# EAGLE schematic EMMA_ultrasonic_sensor_bus (EAGLE 6.5.0)
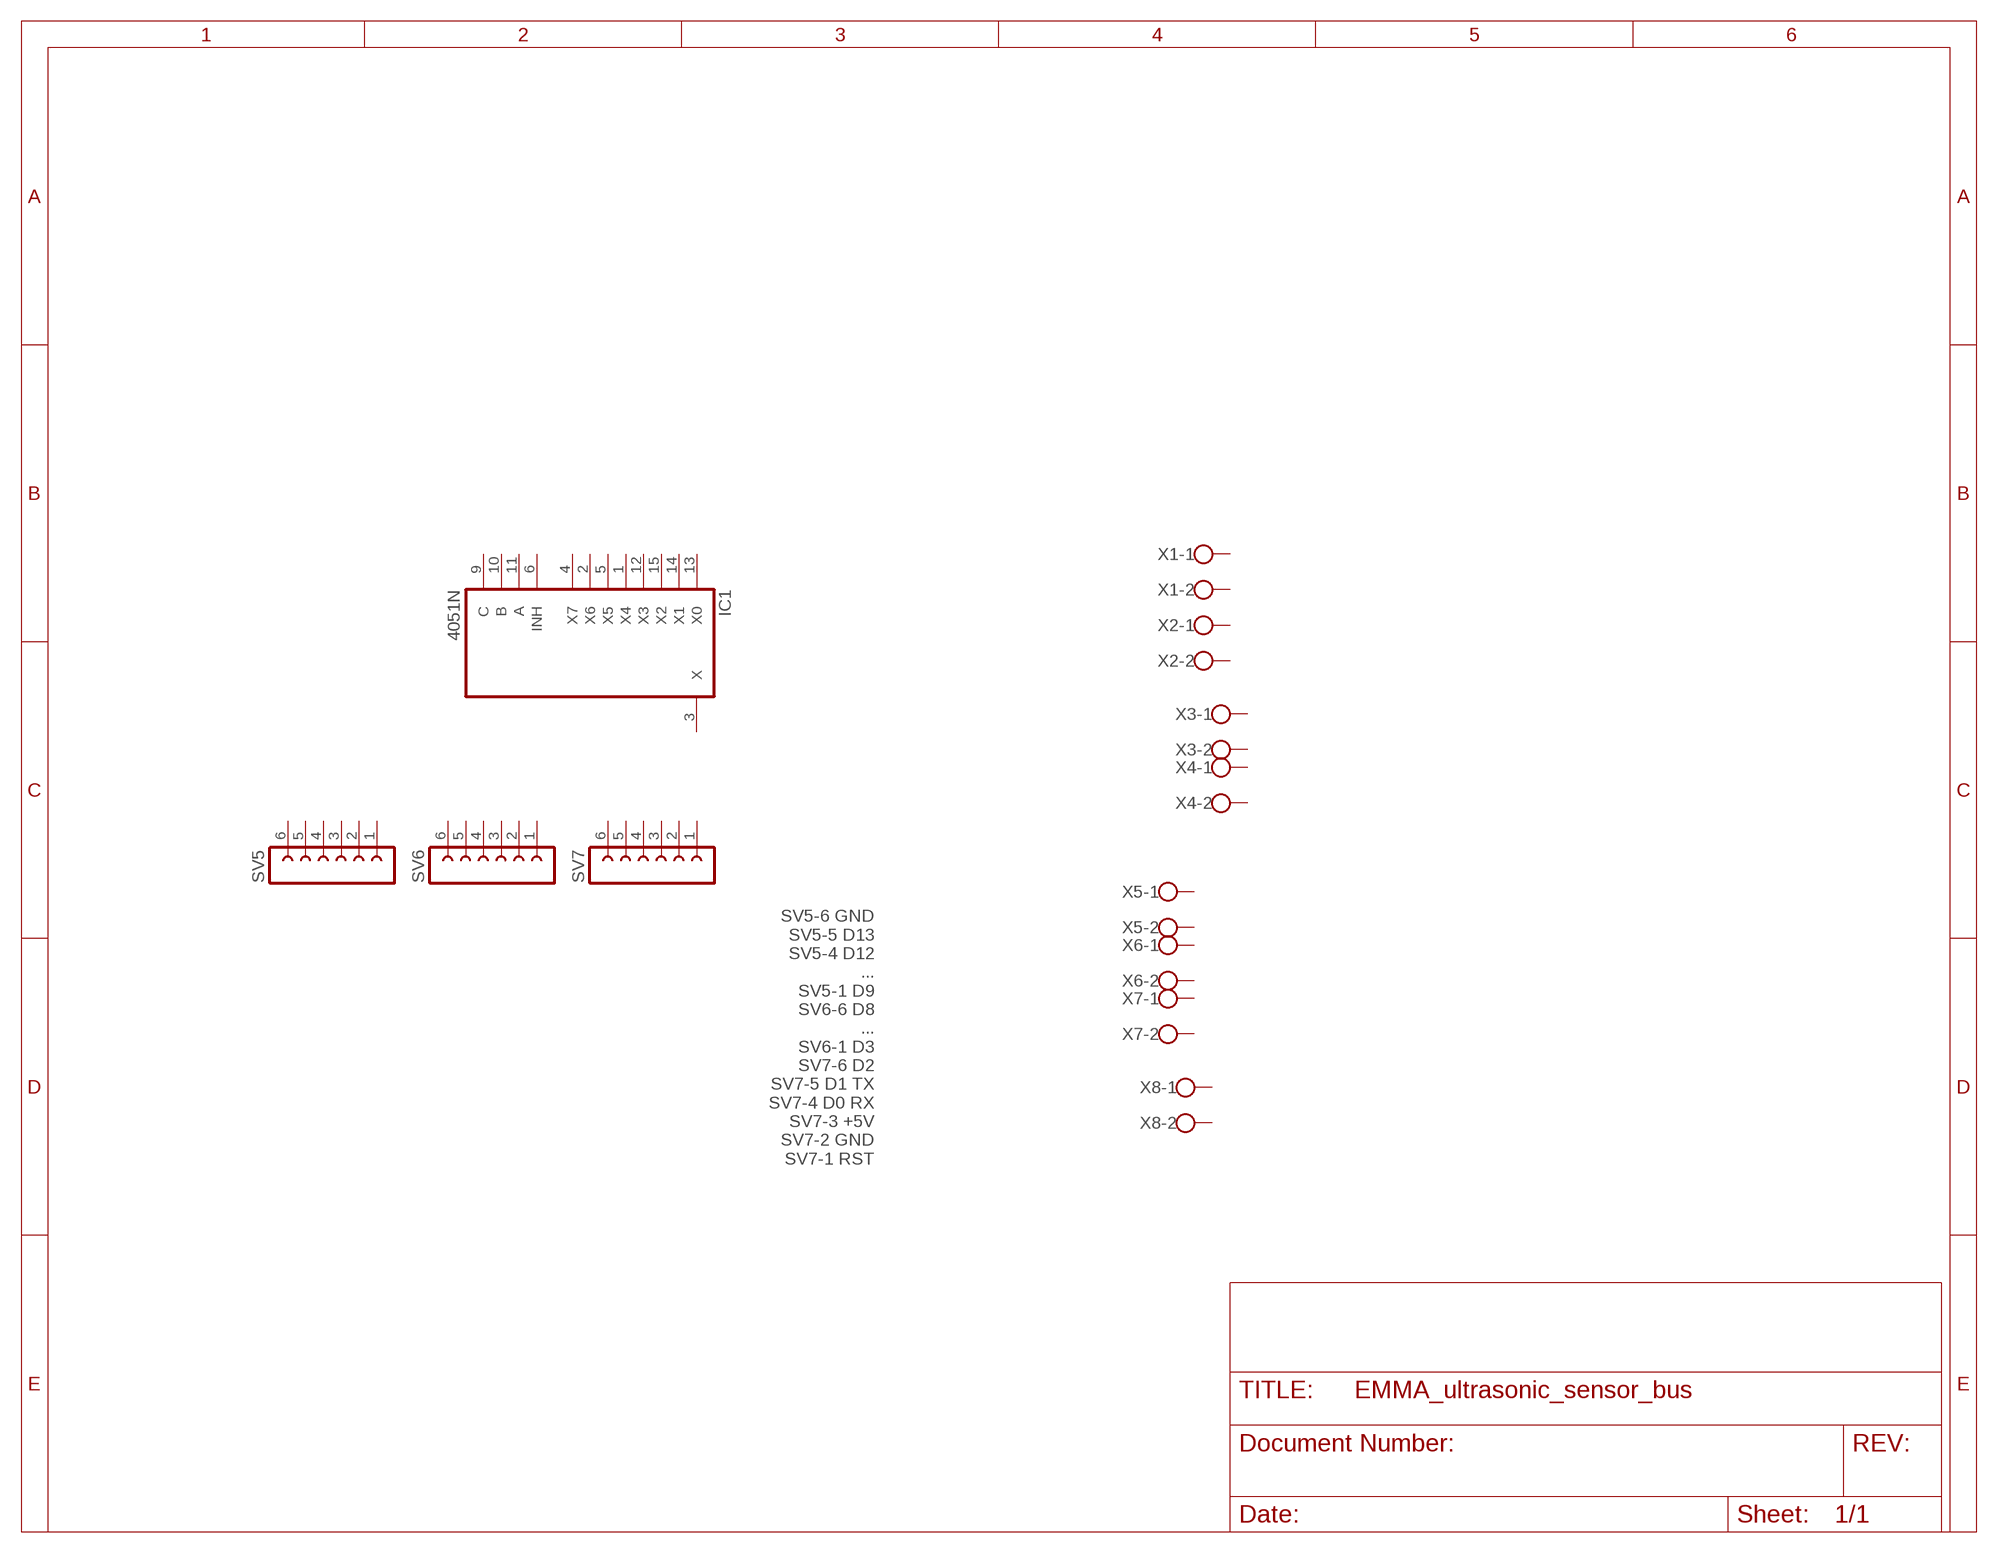
[diagram p0: schematic, sheet 1]

## Parts
IC1  4051N  [DIL16]
SV5  FE06-1  [FE06]
SV6  FE06-1  [FE06]
SV7  FE06-1  [FE06]
X1  W237-102  [W237-102]
X2  W237-102  [W237-102]
X3  W237-102  [W237-102]
X4  W237-102  [W237-102]
X5  W237-102  [W237-102]
X6  W237-102  [W237-102]
X7  W237-102  [W237-102]
X8  W237-102  [W237-102]
Unconnected: IC1.1(X4) IC1.2(X6) IC1.3(X) IC1.4(X7) IC1.5(X5) IC1.6(INH) IC1.9(C) IC1.10(B) IC1.11(A) IC1.12(X3) IC1.13(X0) IC1.14(X1) IC1.15(X2) SV5.1 SV5.2 SV5.3 SV5.4 SV5.5 SV5.6 SV6.1 SV6.2 SV6.3 SV6.4 SV6.5 SV6.6 SV7.1 SV7.2 SV7.3 SV7.4 SV7.5 SV7.6 X1.1 X1.2 X2.1 X2.2 X3.1 X3.2 X4.1 X4.2 X5.1 X5.2 X6.1 X6.2 X7.1 X7.2 X8.1 X8.2

## Notes on the sheet
- SV5-6 GND
  SV5-5 D13
  SV5-4 D12
  ...
  SV5-1 D9
  SV6-6 D8
  ...
  SV6-1 D3
  SV7-6 D2
  SV7-5 D1 TX
  SV7-4 D0 RX
  SV7-3 +5V
  SV7-2 GND
  SV7-1 RST

## Power pins joined to a net without a drawn wire
GND: IC1.8(GND)
VCC: IC1.16(VCC)
VEE: IC1.7(VEE)

## Library data of the parts
IC1 = 40xx:4051: 8-channel ANALOG MULTIPLEXER
SV5-SV7 = con-lsta:FE06-1: FEMALE HEADER; OC_FARNELL: unknown; OC_NEWARK: unknown
X1-X8 = con-wago-500:W237-102: WAGO SCREW CLAMP; MPN: 237-102; OC_FARNELL: unknown; OC_NEWARK: 70K9898